# EasyEDA schematic SCH_RoboFootball_2024-06-07.json
TITLE: Main Board; REV: 1.1; Date: 2024-06-07; Sheet: 1/1; Company: Oellermann Industries
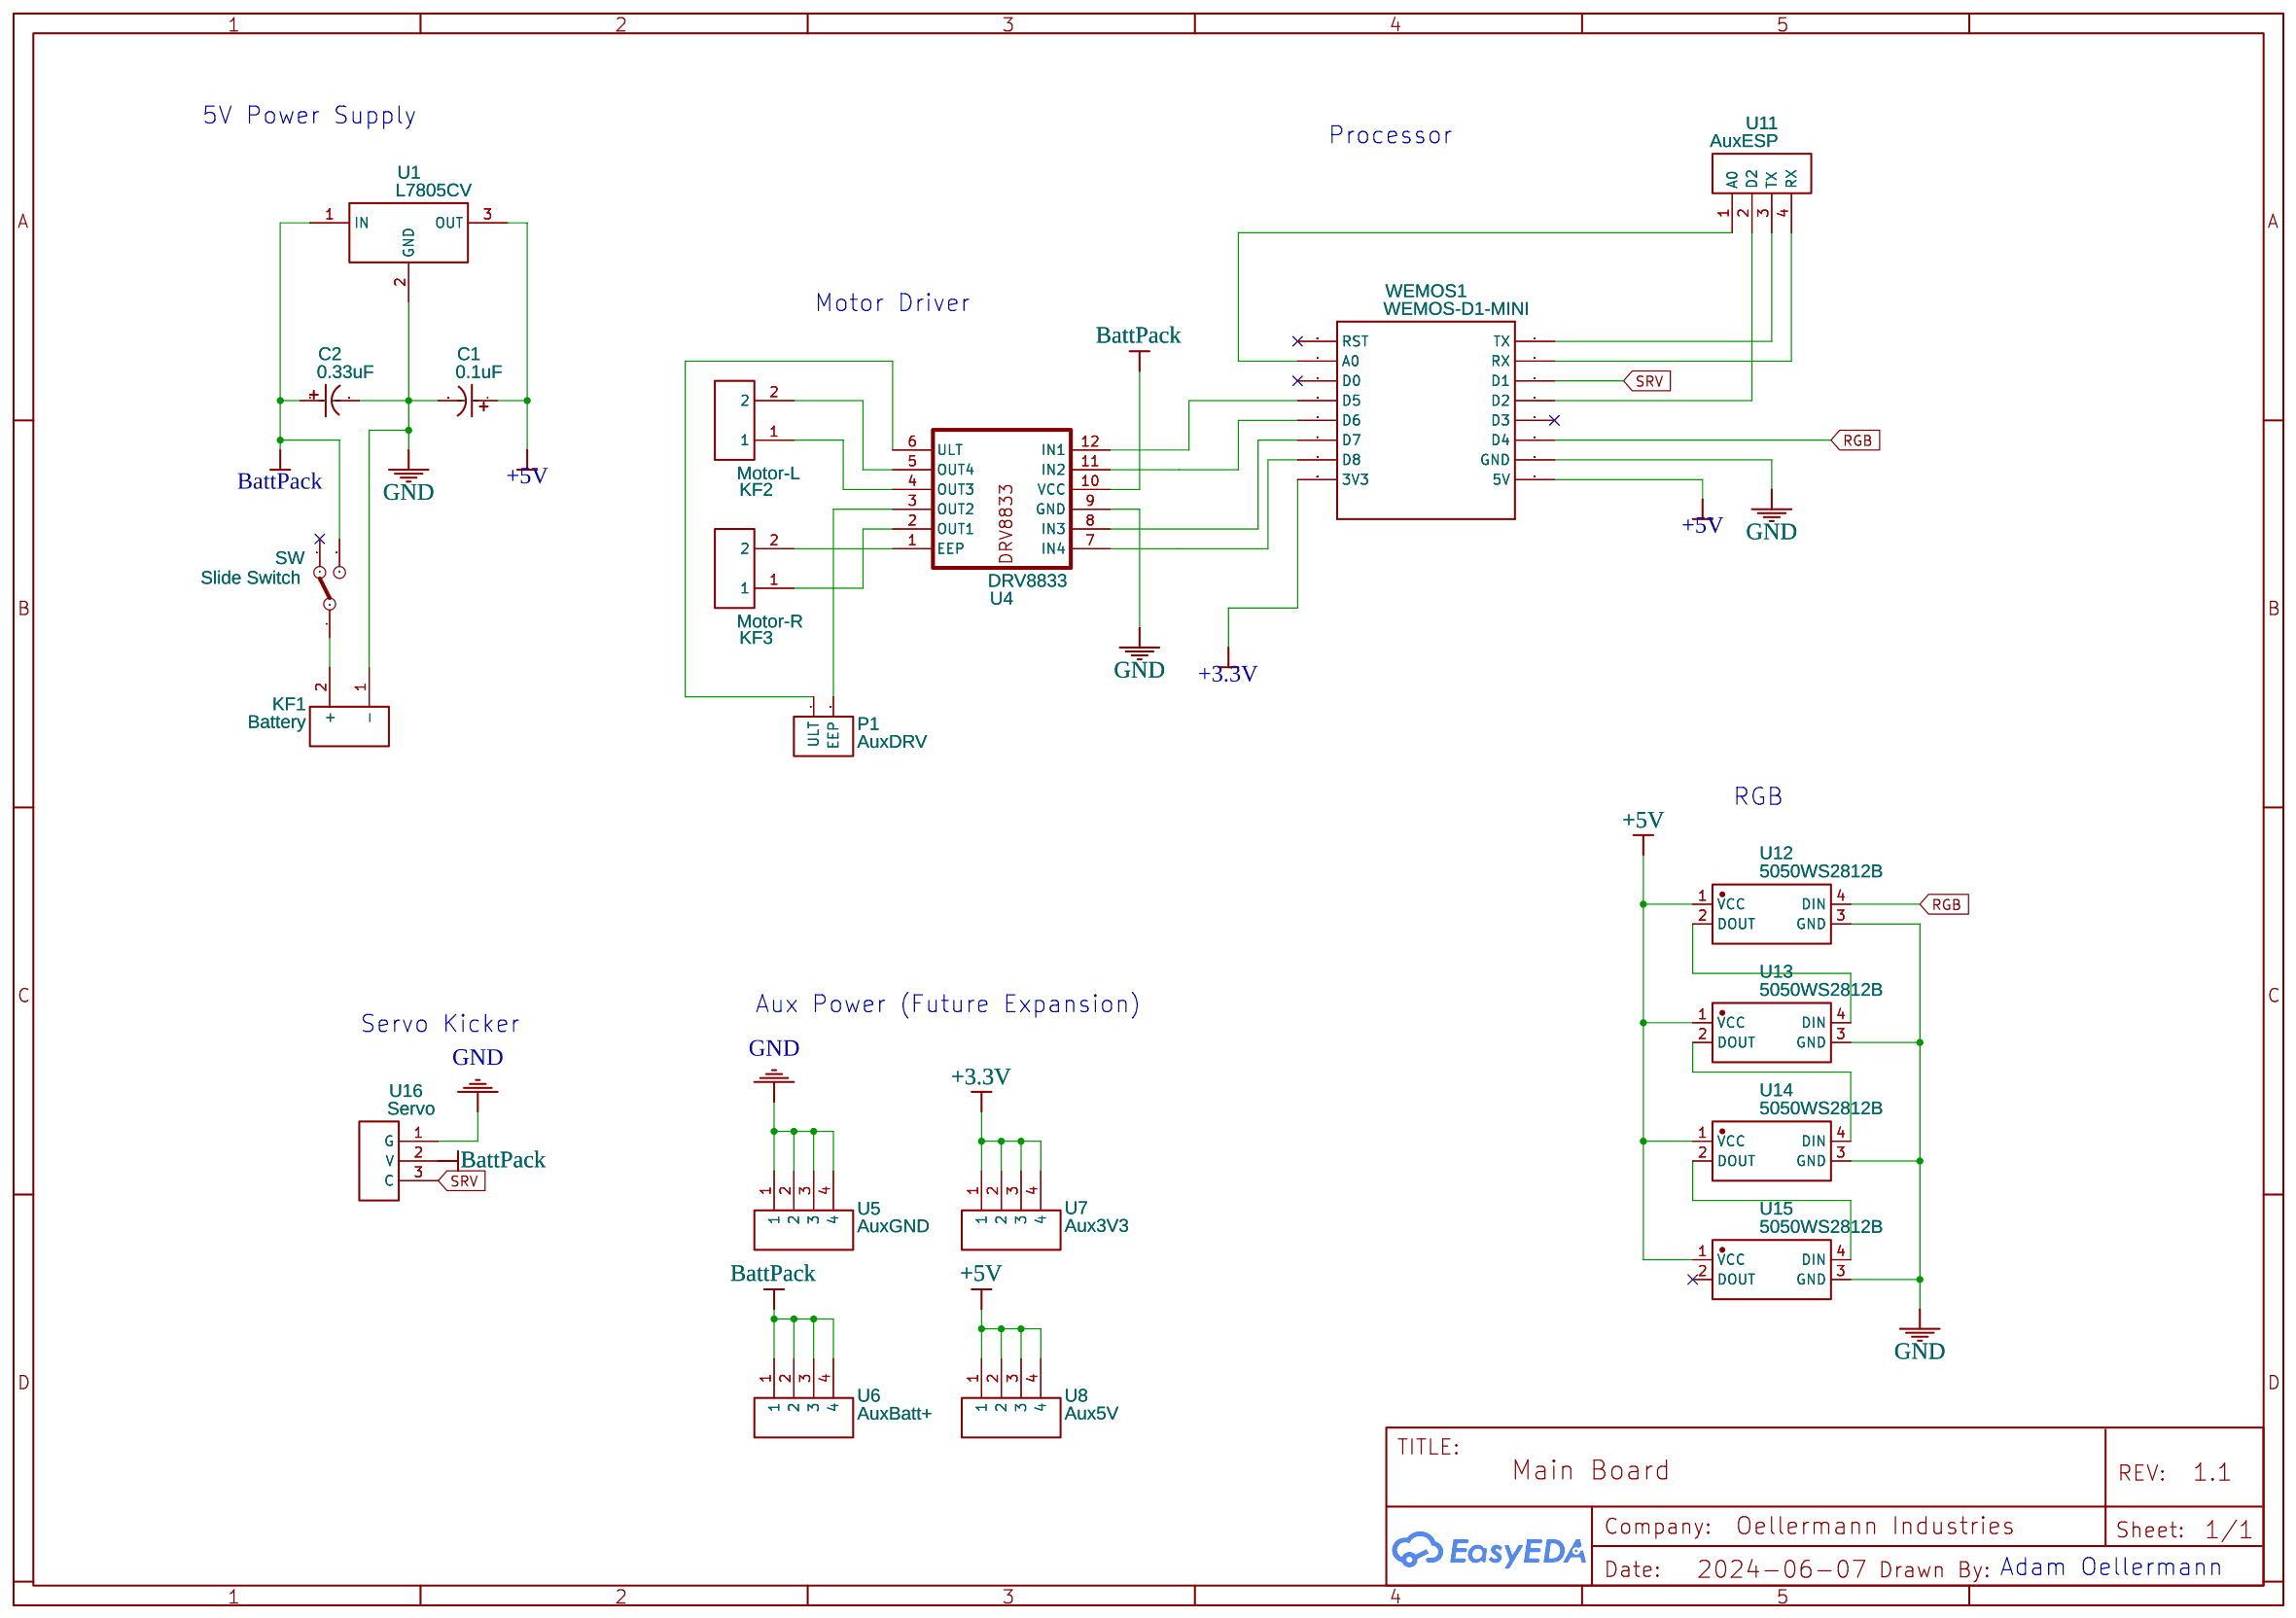
[diagram p0: schematic sheet]

## Parts
C1  0.1uF  [CAP-TH_BD4.0-P1.50-D0.8-FD]
C2  0.33uF  [CAP-TH_BD4.0-P1.50-D0.8-FD]
KF1  Battery  [KF-301-2P]
KF2  Motor-L  [KF-301-2P]
KF3  Motor-R  [KF-301-2P]
P1  AuxDRV  [HDR-TH_2P-P2.54-V-F]
SW  Slide Switch  [SWITCH-SPDT_MINI_SLIDE]
U1  L7805CV  [TO-220-3_L10.0-W4.5-P2.54-L]
U4  DRV8833  [DRV8833 (NO ORIGINAL)]
U5  AuxGND  [PINHEADER1X4]
U6  AuxBatt+  [PINHEADER1X4]
U7  Aux3V3  [PINHEADER1X4]
U8  Aux5V  [PINHEADER1X4]
U11  AuxESP  [PINHEADER1X4]
U12  5050WS2812B  [LED-SMD_5050WS2812B]
U13  5050WS2812B  [LED-SMD_5050WS2812B]
U14  5050WS2812B  [LED-SMD_5050WS2812B]
U15  5050WS2812B  [LED-SMD_5050WS2812B]
U16  Servo  [PINHEADER1X3]
WEMOS1  WEMOS-D1-MINI  [WEMOS-D1-MINI]

## Library data of the parts
C1 = 0.1uF 50V 4*7: Supplier: LCSC; Manufacturer: ValuePro; Supplier Part: C45664; JLCPCB Part Class: Extended Part
C2 = 0.33uF 50V 4*7: Supplier: LCSC; Manufacturer: ValuePro; Supplier Part: C47875; JLCPCB Part Class: Extended Part
KF1-KF3 = K-301-2P: Contributor: auberrub
P1 = Header-Female-2.54_1x2: Supplier: LCSC; Manufacturer: BOOMELE; Manufacturer Part: 2.54-1*2PFemale; Supplier Part: C49661; JLCPCB Part Class: Extended Part
SW = Slide Switch: Manufacturer Part: Switch SPDT; Contributor: hofteboy; Mounted: No
U1 = L7805CV: Supplier: LCSC; Manufacturer: STMicroelectronics; Supplier Part: C111887; JLCPCB Part Class: Extended Part
U4 = DRV8833 (NO ORIGINAL): Contributor: PiterSantaCruz
U5-U8 U11 = PINHEADER1X4: Supplier Part: undefined; Contributor: tek09; PİN P: FSFS
U12-U15 = 5050WS2812B: Supplier: LCSC; Supplier Part: C2874876; Manufacturer: null; JLCPCB Part Class: Extended Part; Contributor: LCSC
U16 = PINHEADER1X3: Manufacturer Part: Pin_Header_2; Contributor: Wetronics
WEMOS1 = WEMOS-D1-MINI: WeMos.cc; Contributor: beerreason

## Nets
+3.3V: U7.1 U7.2 U7.3 U7.4 WEMOS1.3V3
+5V: C1.1 U1.3(OUT) U8.1 U8.2 U8.3 U8.4 U12.1(VCC) U13.1(VCC) U14.1(VCC) U15.1(VCC) WEMOS1.5V
GND: C1.2 C2.2 KF1.1(-) U1.2(GND) U4.9(GND) U5.1 U5.2 U5.3 U5.4 U12.3(GND) U13.3(GND) U14.3(GND) U15.3(GND) U16.1(G) WEMOS1.GND
BattPack: C2.1 SW.3(NO) U1.1(IN) U4.10(VCC) U6.1 U6.2 U6.3 U6.4 U16.2(V)
RGB: U12.4(DIN) WEMOS1.D4
SRV: U16.3(C) WEMOS1.D1
Net-(KF1-2): KF1.2(+) SW.1(NC)
Net-(KF2-1): KF2.1 U4.4(OUT3)
Net-(KF2-2): KF2.2 U4.5(OUT4)
Net-(KF3-1): KF3.1 U4.2(OUT1)
Net-(KF3-2): KF3.2 P1.1(EEP) U4.1(EEP) U4.3(OUT2)
Net-(P1-2): P1.2(ULT) U4.6(ULT)
Net-(U4-7): U4.7(IN4) WEMOS1.D8
Net-(U4-8): U4.8(IN3) WEMOS1.D7
Net-(U4-11): U4.11(IN2) WEMOS1.D6
Net-(U4-12): U4.12(IN1) WEMOS1.D5
Net-(U11-1): U11.1(A0) WEMOS1.A0
Net-(U11-2): U11.2(D2) WEMOS1.D2
Net-(U11-3): U11.3(TX) WEMOS1.TX
Net-(U11-4): U11.4(RX) WEMOS1.RX
Net-(U12-2): U12.2(DOUT) U13.4(DIN)
Net-(U13-2): U13.2(DOUT) U14.4(DIN)
Net-(U14-2): U14.2(DOUT) U15.4(DIN)

Not connected (* = marked no-connect by the designer): SW 2(C)*; U15 2(DOUT)*; WEMOS1 D0* D3* RST*

## Notes on the sheet
- 5V Power Supply
- Processor
- Motor Driver
- RGB
- Aux Power (Future Expansion)
- Servo Kicker
- Adam Oellermann
